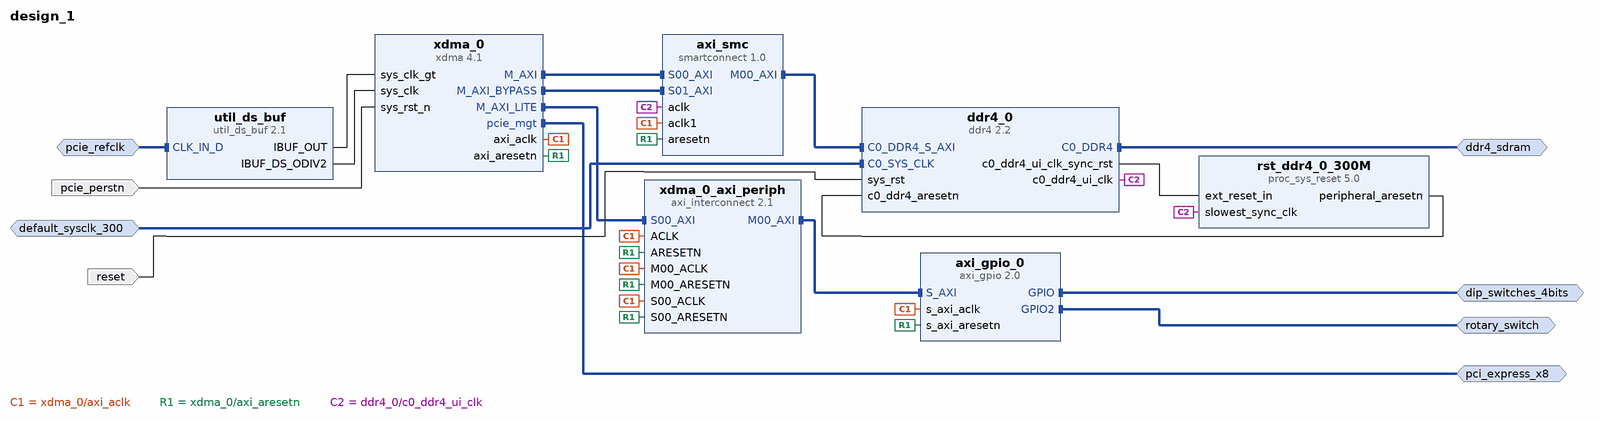
[diagram p0: block diagram of the top level]
# Vivado block design design_1, xcku040-ffva1156-2-e, Vivado 2019.2
create_bd_design design_1

create_bd_intf_port -mode Master -vlnv xilinx.com:interface:gpio_rtl:1.0 dip_switches_4bits
create_bd_intf_port -mode Master -vlnv xilinx.com:interface:gpio_rtl:1.0 rotary_switch
create_bd_intf_port -mode Master -vlnv xilinx.com:interface:pcie_7x_mgt_rtl:1.0 pci_express_x8
create_bd_intf_port -mode Master -vlnv xilinx.com:interface:ddr4_rtl:1.0 ddr4_sdram
create_bd_intf_port -mode Slave -vlnv xilinx.com:interface:diff_clock_rtl:1.0 pcie_refclk
set_property -dict {CONFIG.FREQ_HZ 100000000} [get_bd_intf_ports pcie_refclk]
create_bd_intf_port -mode Slave -vlnv xilinx.com:interface:diff_clock_rtl:1.0 default_sysclk_300
set_property -dict {CONFIG.FREQ_HZ 300000000} [get_bd_intf_ports default_sysclk_300]
create_bd_port -dir I -type rst pcie_perstn
set_property -dict {CONFIG.POLARITY ACTIVE_LOW} [get_bd_ports pcie_perstn]
create_bd_port -dir I -type rst reset
set_property -dict {CONFIG.POLARITY ACTIVE_HIGH} [get_bd_ports reset]

create_bd_cell -type ip -vlnv xilinx.com:ip:axi_gpio:2.0 axi_gpio_0
set_property -dict [list \
  CONFIG.GPIO2_BOARD_INTERFACE rotary_switch \
  CONFIG.GPIO_BOARD_INTERFACE dip_switches_4bits \
  CONFIG.USE_BOARD_FLOW true \
] [get_bd_cells axi_gpio_0]
create_bd_cell -type ip -vlnv xilinx.com:ip:xdma:4.1 xdma_0
set_property -dict [list \
  CONFIG.PCIE_BOARD_INTERFACE pci_express_x8 \
  CONFIG.SYS_RST_N_BOARD_INTERFACE pcie_perstn \
  CONFIG.axi_data_width 256_bit \
  CONFIG.axilite_master_en true \
  CONFIG.axist_bypass_en true \
  CONFIG.axist_bypass_size 1 \
  CONFIG.axisten_freq 250 \
  CONFIG.pciebar2axibar_axil_master 0xC0000000 \
  CONFIG.pciebar2axibar_axist_bypass 0xE0000000 \
  CONFIG.pl_link_cap_max_link_speed 8.0_GT/s \
  CONFIG.xdma_axi_intf_mm AXI_Memory_Mapped \
  CONFIG.xdma_rnum_chnl 4 \
  CONFIG.xdma_wnum_chnl 4 \
] [get_bd_cells xdma_0]
create_bd_cell -type ip -vlnv xilinx.com:ip:ddr4:2.2 ddr4_0
set_property -dict [list \
  CONFIG.C0_CLOCK_BOARD_INTERFACE default_sysclk_300 \
  CONFIG.C0_DDR4_BOARD_INTERFACE ddr4_sdram \
  CONFIG.RESET_BOARD_INTERFACE reset \
] [get_bd_cells ddr4_0]
create_bd_cell -type ip -vlnv xilinx.com:ip:util_ds_buf:2.1 util_ds_buf
set_property -dict {CONFIG.DIFF_CLK_IN_BOARD_INTERFACE pcie_refclk CONFIG.USE_BOARD_FLOW true} [get_bd_cells util_ds_buf]
create_bd_cell -type ip -vlnv xilinx.com:ip:axi_interconnect:2.1 xdma_0_axi_periph
set_property -dict {CONFIG.NUM_MI 1} [get_bd_cells xdma_0_axi_periph]
create_bd_cell -type ip -vlnv xilinx.com:ip:smartconnect:1.0 axi_smc
set_property -dict {CONFIG.NUM_CLKS 2 CONFIG.NUM_SI 2} [get_bd_cells axi_smc]
create_bd_cell -type ip -vlnv xilinx.com:ip:proc_sys_reset:5.0 rst_ddr4_0_300M

# ---- connections ----

connect_bd_intf_net [get_bd_intf_pins xdma_0/M_AXI] [get_bd_intf_pins axi_smc/S00_AXI]
connect_bd_intf_net [get_bd_intf_ports dip_switches_4bits] [get_bd_intf_pins axi_gpio_0/GPIO]
connect_bd_intf_net [get_bd_intf_pins xdma_0/M_AXI_BYPASS] [get_bd_intf_pins axi_smc/S01_AXI]
connect_bd_intf_net [get_bd_intf_ports pci_express_x8] [get_bd_intf_pins xdma_0/pcie_mgt]
connect_bd_intf_net [get_bd_intf_ports ddr4_sdram] [get_bd_intf_pins ddr4_0/C0_DDR4]
connect_bd_intf_net -intf_net default_sysclk_300_1 [get_bd_intf_ports default_sysclk_300] [get_bd_intf_pins ddr4_0/C0_SYS_CLK]
connect_bd_intf_net [get_bd_intf_pins axi_smc/M00_AXI] [get_bd_intf_pins ddr4_0/C0_DDR4_S_AXI]
connect_bd_intf_net [get_bd_intf_ports pcie_refclk] [get_bd_intf_pins util_ds_buf/CLK_IN_D]
connect_bd_intf_net [get_bd_intf_pins xdma_0_axi_periph/M00_AXI] [get_bd_intf_pins axi_gpio_0/S_AXI]
connect_bd_intf_net [get_bd_intf_pins xdma_0/M_AXI_LITE] [get_bd_intf_pins xdma_0_axi_periph/S00_AXI]
connect_bd_intf_net [get_bd_intf_ports rotary_switch] [get_bd_intf_pins axi_gpio_0/GPIO2]
connect_bd_net [get_bd_ports pcie_perstn] [get_bd_pins xdma_0/sys_rst_n]
connect_bd_net [get_bd_pins util_ds_buf/IBUF_OUT] [get_bd_pins xdma_0/sys_clk_gt]
connect_bd_net [get_bd_pins util_ds_buf/IBUF_DS_ODIV2] [get_bd_pins xdma_0/sys_clk]
connect_bd_net [get_bd_pins xdma_0/axi_aclk] \
  [get_bd_pins xdma_0_axi_periph/S00_ACLK] [get_bd_pins axi_gpio_0/s_axi_aclk] [get_bd_pins xdma_0_axi_periph/M00_ACLK] \
  [get_bd_pins xdma_0_axi_periph/ACLK] [get_bd_pins axi_smc/aclk1]
connect_bd_net [get_bd_pins xdma_0/axi_aresetn] \
  [get_bd_pins xdma_0_axi_periph/S00_ARESETN] [get_bd_pins axi_gpio_0/s_axi_aresetn] \
  [get_bd_pins xdma_0_axi_periph/M00_ARESETN] [get_bd_pins xdma_0_axi_periph/ARESETN] [get_bd_pins axi_smc/aresetn]
connect_bd_net [get_bd_pins ddr4_0/c0_ddr4_ui_clk] [get_bd_pins axi_smc/aclk] [get_bd_pins rst_ddr4_0_300M/slowest_sync_clk]
connect_bd_net [get_bd_pins ddr4_0/c0_ddr4_ui_clk_sync_rst] [get_bd_pins rst_ddr4_0_300M/ext_reset_in]
connect_bd_net [get_bd_pins rst_ddr4_0_300M/peripheral_aresetn] [get_bd_pins ddr4_0/c0_ddr4_aresetn]
connect_bd_net [get_bd_ports reset] [get_bd_pins ddr4_0/sys_rst]

# ---- address map ----
assign_bd_address -offset 0x0000000080000000 -range 2G -target_address_space [get_bd_addr_spaces xdma_0/M_AXI] [get_bd_addr_segs ddr4_0/C0_DDR4_MEMORY_MAP/C0_DDR4_ADDRESS_BLOCK]
assign_bd_address -offset 0x0000000080000000 -range 2G -target_address_space [get_bd_addr_spaces xdma_0/M_AXI_BYPASS] [get_bd_addr_segs ddr4_0/C0_DDR4_MEMORY_MAP/C0_DDR4_ADDRESS_BLOCK]
assign_bd_address -offset 0x00000000 -range 64K -target_address_space [get_bd_addr_spaces xdma_0/M_AXI_LITE] [get_bd_addr_segs axi_gpio_0/S_AXI/Reg]

validate_bd_design
save_bd_design
